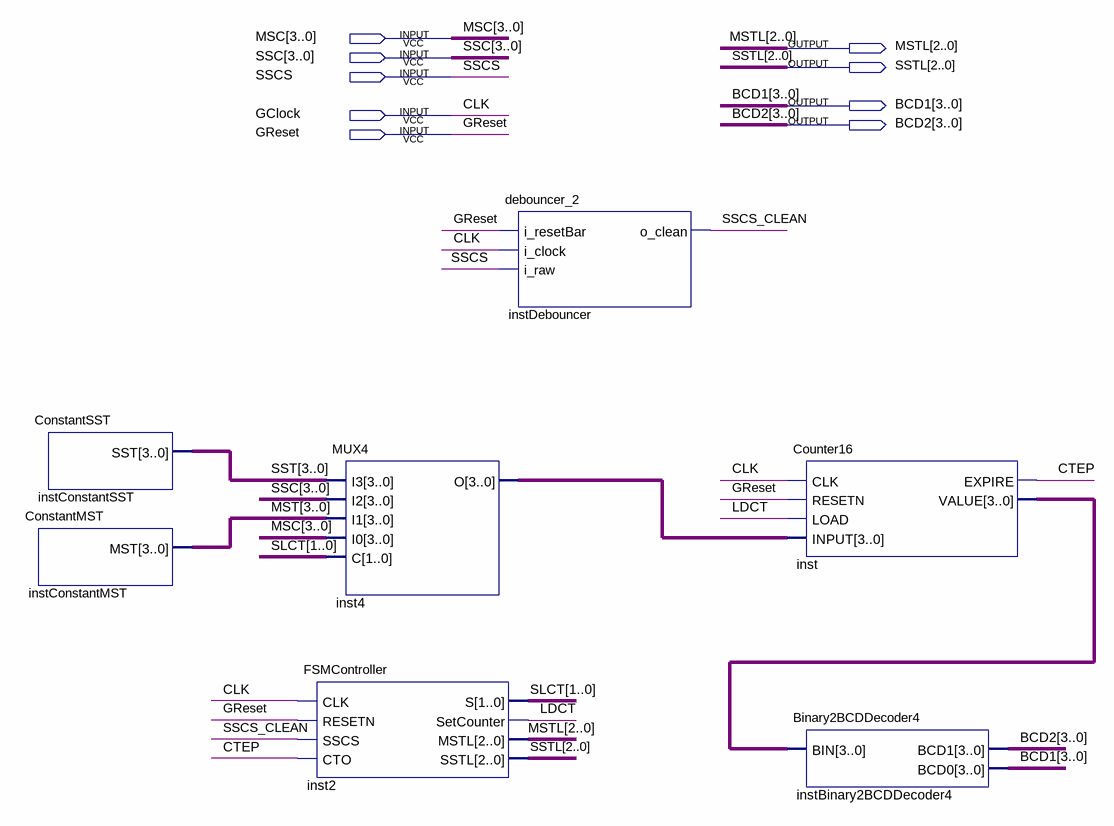
[diagram p0: schematic sheet]
// Quartus schematic TrafficLightController.bdf as structural Verilog: 7 symbols, 9 pins
module TrafficLightController (
  input  [3:0] MSC,
  input  [3:0] SSC,
  input  SSCS,
  input  GClock,
  input  GReset,
  output [2:0] MSTL,
  output [2:0] SSTL,
  output [3:0] BCD1,
  output [3:0] BCD2
);

  wire CTEP, LDCT, SSCS_CLEAN;
  wire [1:0] SLCT;
  wire [3:0] inst4_o, inst_value, MST, SST;

  ConstantSST instConstantSST (.SST(SST));
  ConstantMST instConstantMST (.MST(MST));
  MUX4 inst4 (.I3(SST), .I2(SSC), .I1(MST), .I0(MSC), .C(SLCT), .O(inst4_o));
  FSMController inst2 (
    .CLK(GClock), .RESETN(GReset), .SSCS(SSCS_CLEAN), .CTO(CTEP), .S(SLCT), .SetCounter(LDCT), .MSTL(MSTL),
    .SSTL(SSTL));
  debouncer_2 instDebouncer (.i_resetBar(GReset), .i_clock(GClock), .i_raw(SSCS), .o_clean(SSCS_CLEAN));
  Counter16 inst (.CLK(GClock), .RESETN(GReset), .LOAD(LDCT), .INPUT(inst4_o), .EXPIRE(CTEP), .VALUE(inst_value));
  Binary2BCDDecoder4 instBinary2BCDDecoder4 (.BIN(inst_value), .BCD1(BCD2), .BCD0(BCD1));

  // Other names for the same wires on the sheet: CLK = GClock
endmodule
